# Altium schematic sheet Private_CPU_SerDes.SchDoc
size D
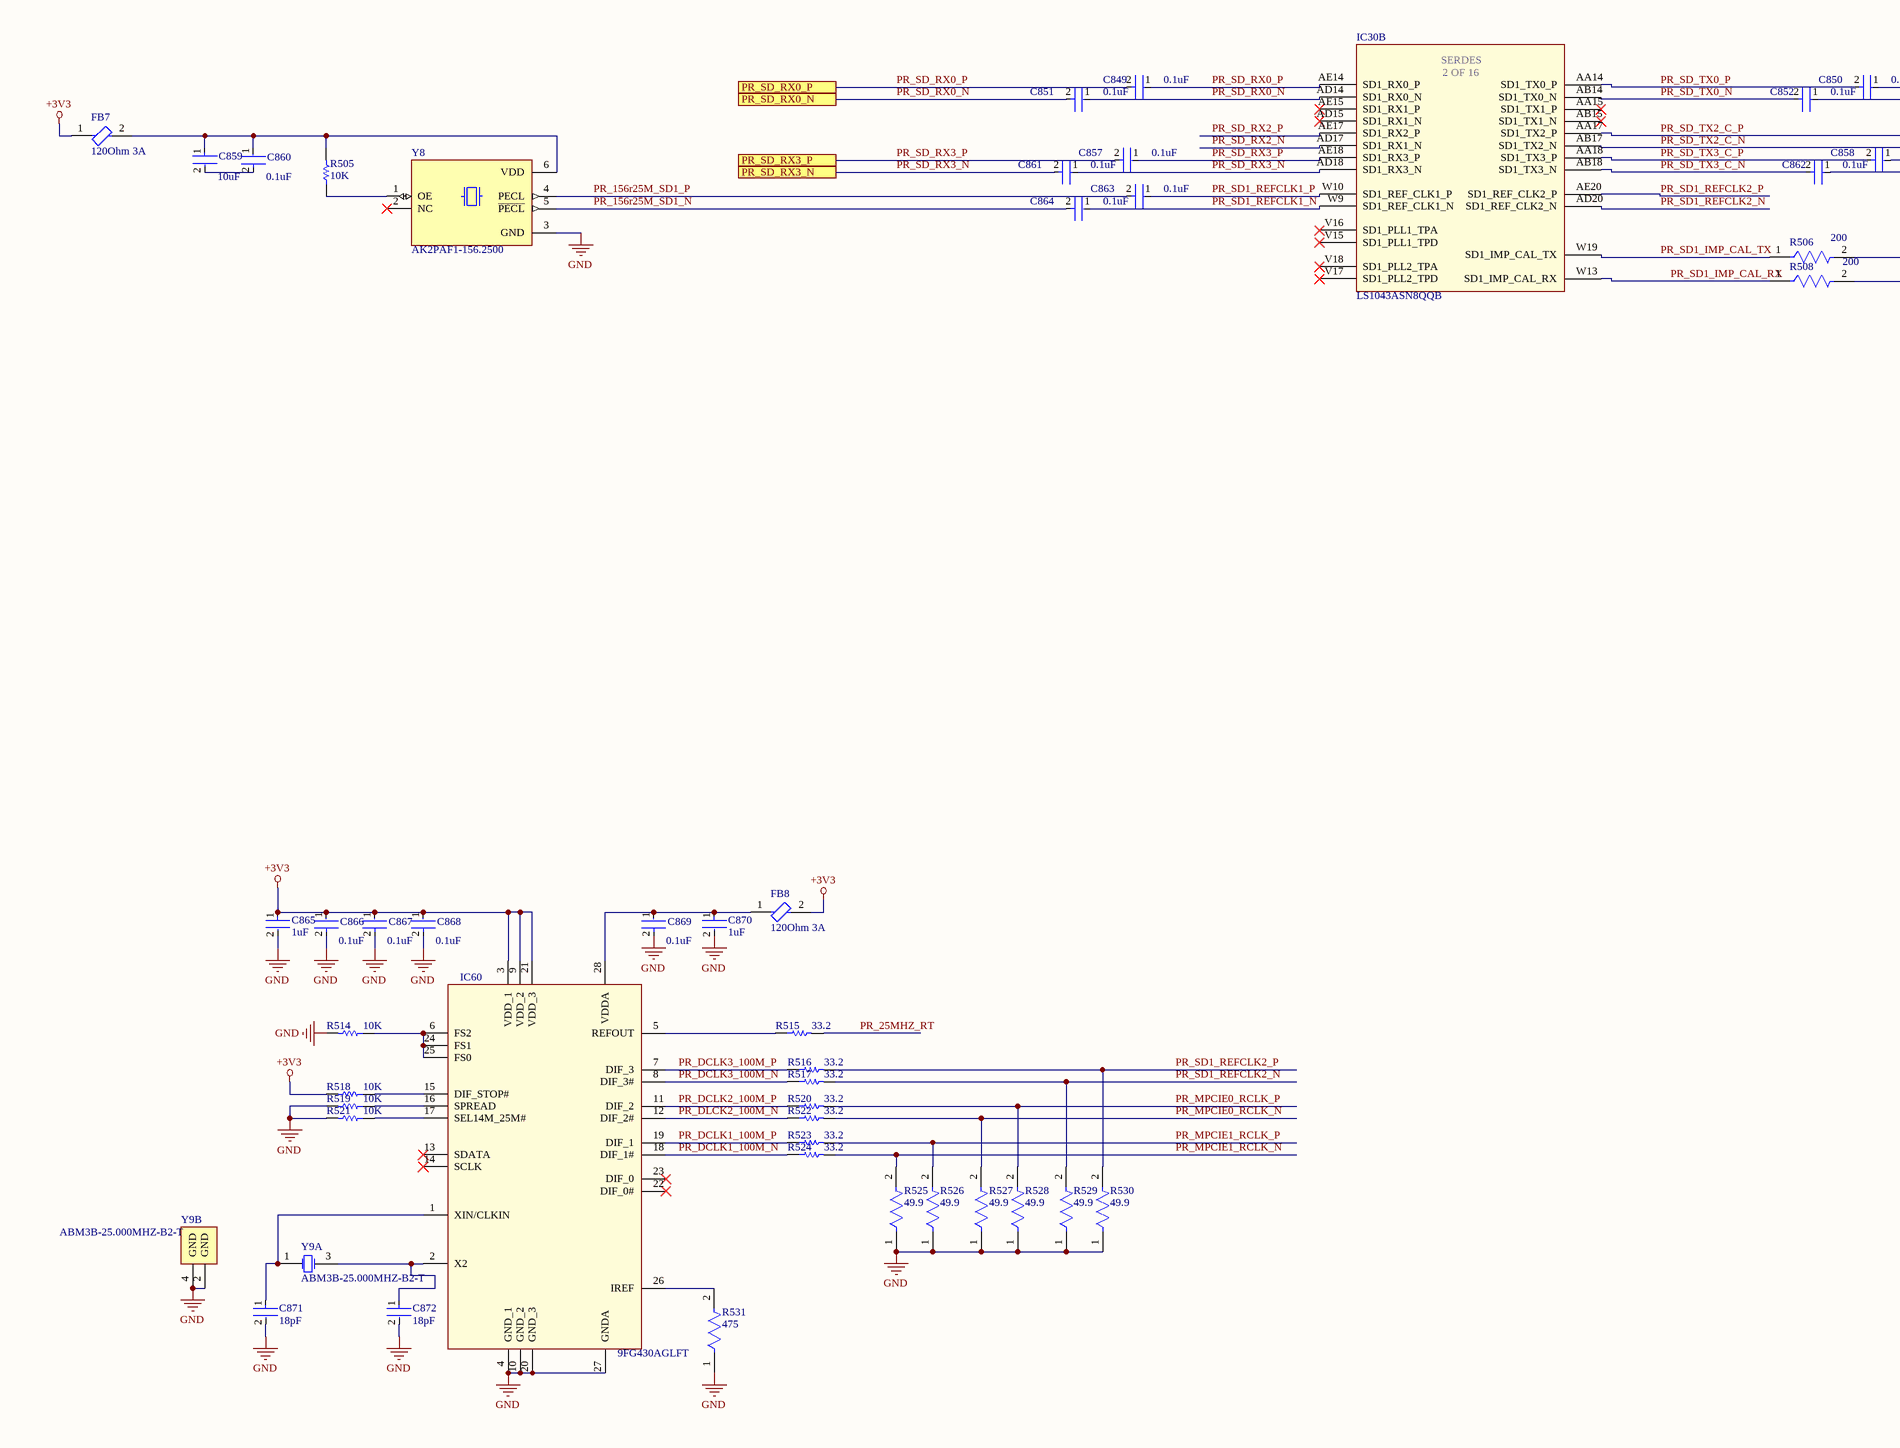
[diagram p0: Private_CPU_SerDes.SchDoc, left]
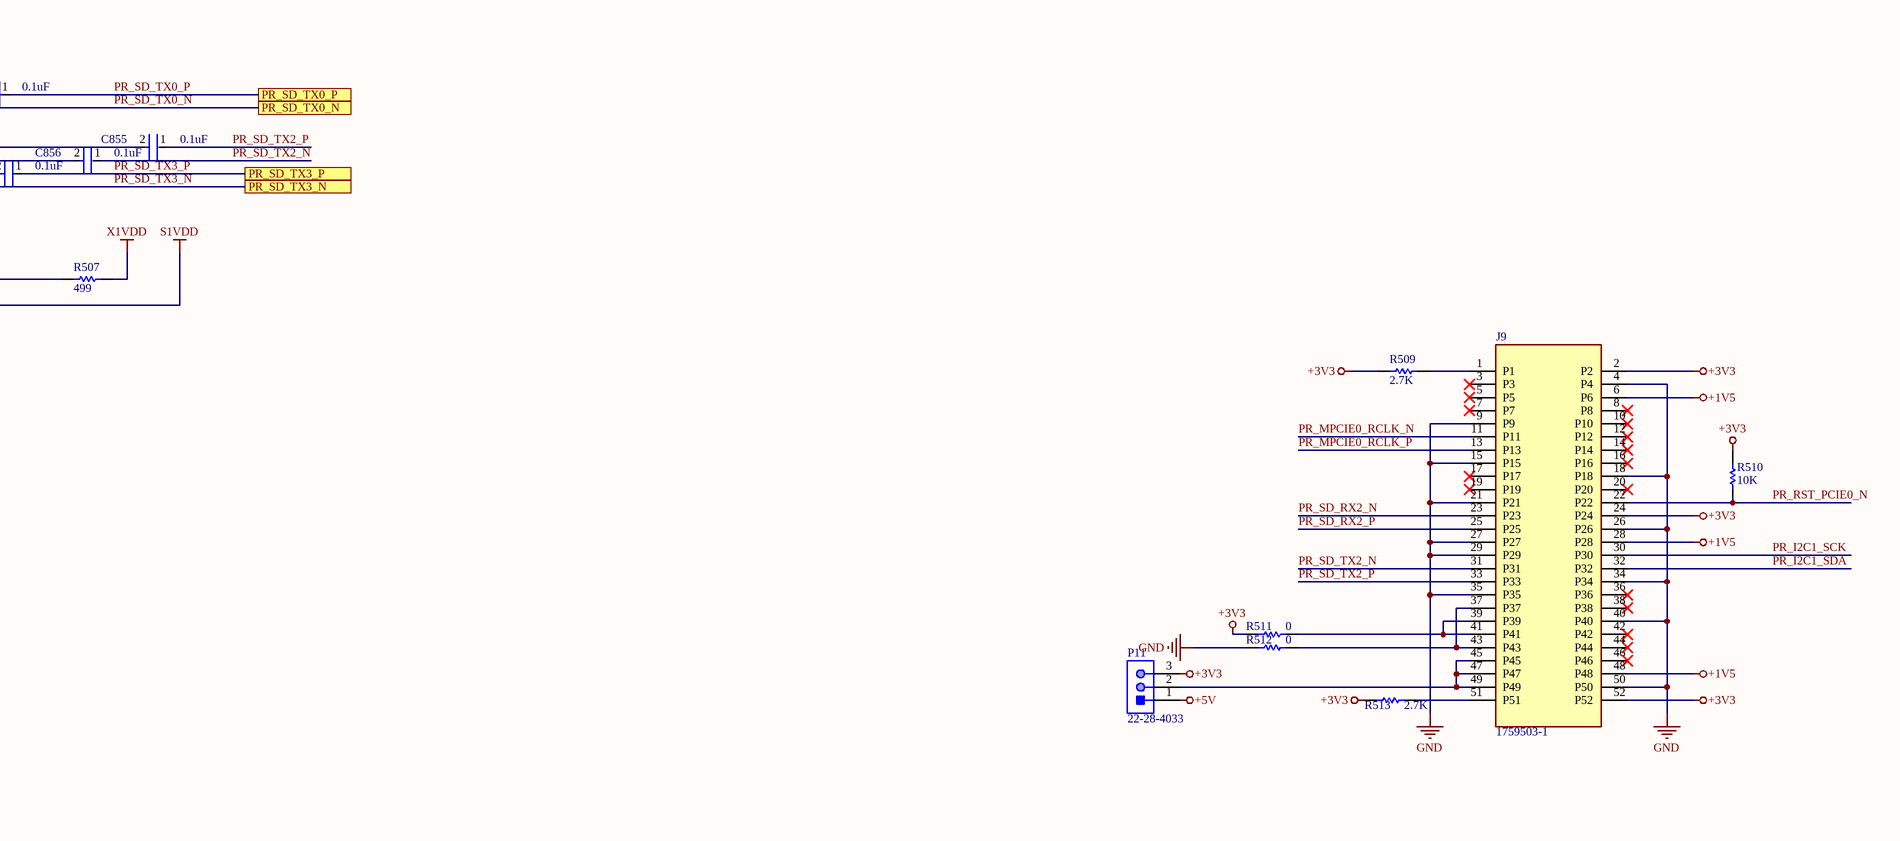
[diagram p1: Private_CPU_SerDes.SchDoc, right]

## Parts
C849  0.1uF  [FP-GRM15-MFG]
C850  0.1uF  [FP-GRM15-MFG]
C851  0.1uF  [FP-GRM15-MFG]
C852  0.1uF  [FP-GRM15-MFG]
C855  0.1uF  [FP-GRM15-MFG]
C856  0.1uF  [FP-GRM15-MFG]
C857  0.1uF  [FP-GRM15-MFG]
C858  0.1uF  [FP-GRM15-MFG]
C859  10uF  [FP-C0805C-DG-MFG]
C860  0.1uF  [FP-GRM15-MFG]
C861  0.1uF  [FP-GRM15-MFG]
C862  0.1uF  [FP-GRM15-MFG]
C863  0.1uF  [FP-GRM15-MFG]
C864  0.1uF  [FP-GRM15-MFG]
C865  1uF  [FP-GRM15-0_1-MFG]
C866  0.1uF  [FP-GRM15-MFG]
C867  0.1uF  [FP-GRM15-MFG]
C868  0.1uF  [FP-GRM15-MFG]
C869  0.1uF  [FP-GRM15-MFG]
C870  1uF  [FP-GRM15-0_1-MFG]
C871  18pF  [FP-C0402-BB-MFG]
C872  18pF  [FP-C0402-BB-MFG]
FB7  120Ohm 3A  [FP-BLM18-0_15-t0_5-d1_2-MFG]
FB8  120Ohm 3A  [FP-BLM18-0_15-t0_5-d1_2-MFG]
IC30  LS1043ASN8QQB  [BGA780C80P28X28_2300X2300X261]  (part B of 16)
IC60  9FG430AGLFT  [SOP65P640X120-28N]
J9  1759503-1  [TE_1759503-1]
P11  22-28-4033  [MOLX-22-28-4033_V]
R505  10K  [RESC1005X40X25LL05T05]
R506  200  [FP-CRCW0402-e3-IPC_C]
R507  499  [RESC1005X40X25LL05T05]
R508  200  [FP-CRCW0402-e3-IPC_C]
R509  2.7K  [RESC1005X40X25NL05T05]
R510  10K  [RESC1005X40X25LL05T05]
R511  0  [RESC2013X50X30LL20T20]
R512  0  [RESC2013X50X30LL20T20]
R513  2.7K  [RESC1005X40X25NL05T05]
R514  10K  [RESC1005X40X25LL05T05]
R515  33.2  [RESC1005X40X25LL05T05]
R516  33.2  [RESC1005X40X25LL05T05]
R517  33.2  [RESC1005X40X25LL05T05]
R518  10K  [RESC1005X40X25LL05T05]
R519  10K  [RESC1005X40X25LL05T05]
R520  33.2  [RESC1005X40X25LL05T05]
R521  10K  [RESC1005X40X25LL05T05]
R522  33.2  [RESC1005X40X25LL05T05]
R523  33.2  [RESC1005X40X25LL05T05]
R524  33.2  [RESC1005X40X25LL05T05]
R525  49.9  [FP-CRCW0402-e3-MFG]
R526  49.9  [FP-CRCW0402-e3-MFG]
R527  49.9  [FP-CRCW0402-e3-MFG]
R528  49.9  [FP-CRCW0402-e3-MFG]
R529  49.9  [FP-CRCW0402-e3-MFG]
R530  49.9  [FP-CRCW0402-e3-MFG]
R531  475  [FP-CRCW0603-e3-IPC_C]
Y8  AK2PAF1-156.2500  [XTAL_AK2PAF1-156.2500]
Y9  ABM3B-25.000MHZ-B2-T  [ABRA-ABM3B-4_V]  (parts A,B of 2)

## Ports
PR_SD_RX0_N, PR_SD_RX0_P, PR_SD_RX3_N, PR_SD_RX3_P, PR_SD_TX0_N, PR_SD_TX0_P, PR_SD_TX3_N, PR_SD_TX3_P

## Nets
+1V5: J9.6(P6) J9.28(P28) J9.48(P48)
+3V3: C865.1 C866.1 C867.1 C868.1 FB7.1 FB8.2 IC60.3(VDD_1) IC60.9(VDD_2) IC60.21(VDD_3) J9.2(P2) J9.24(P24) J9.52(P52) P11.3 R509.2 R510.2 R511.1 R513.2 R518.2
+5V: P11.1
GND: C865.2 C866.2 C867.2 C868.2 C869.2 C870.2 C871.2 C872.2 IC60.4(GND_1) IC60.10(GND_2) IC60.20(GND_3) IC60.27(GNDA) J9.4(P4) J9.9(P9) J9.15(P15) J9.18(P18) J9.21(P21) J9.26(P26) J9.27(P27) J9.29(P29) J9.34(P34) J9.35(P35) J9.40(P40) J9.50(P50) R512.1 R514.2 R519.2 R521.2 R525.1 R526.1 R527.1 R528.1 R529.1 R530.1 R531.1 Y8.3(GND) Y9.2(GND) Y9.4(GND)
S1VDD: R508.2
X1VDD: R507.2
PR_25MHZ_RT: R515.2
PR_156r25M_SD1_N: C864.2 Y8.5(~{PECL})
PR_156r25M_SD1_P: C863.2 Y8.4(PECL)
PR_DCLK1_100M_N: IC60.18(DIF_1#) R524.1
PR_DCLK1_100M_P: IC60.19(DIF_1) R523.1
PR_DCLK2_100M_P: IC60.11(DIF_2) R520.1
PR_DCLK3_100M_N: IC60.8(DIF_3#) R517.1
PR_DCLK3_100M_P: IC60.7(DIF_3) R516.1
PR_DLCK2_100M_N: IC60.12(DIF_2#) R522.1
PR_I2C1_SCK: J9.30(P30)
PR_I2C1_SDA: J9.32(P32)
PR_MPCIE0_RCLK_N: J9.11(P11) R522.2 R527.2
PR_MPCIE0_RCLK_P: J9.13(P13) R520.2 R528.2
PR_MPCIE1_RCLK_N: R524.2 R525.2
PR_MPCIE1_RCLK_P: R523.2 R526.2
PR_RST_PCIE0_N: J9.22(P22) R510.1
PR_SD1_IMP_CAL_RX: IC30.W13(SD1_IMP_CAL_RX) R508.1
PR_SD1_IMP_CAL_TX: IC30.W19(SD1_IMP_CAL_TX) R506.1
PR_SD1_REFCLK1_N: C864.1 IC30.W9(SD1_REF_CLK1_N)
PR_SD1_REFCLK1_P: C863.1 IC30.W10(SD1_REF_CLK1_P)
PR_SD1_REFCLK2_N: IC30.AD20(SD1_REF_CLK2_N) R517.2 R529.2
PR_SD1_REFCLK2_P: IC30.AE20(SD1_REF_CLK2_P) R516.2 R530.2
PR_SD_RX0_N: C851.1 C851.2 IC30.AD14(SD1_RX0_N) ; port PR_SD_RX0_N
PR_SD_RX0_P: C849.1 C849.2 IC30.AE14(SD1_RX0_P) ; port PR_SD_RX0_P
PR_SD_RX2_N: IC30.AD17(SD1_RX1_N) J9.23(P23)
PR_SD_RX2_P: IC30.AE17(SD1_RX2_P) J9.25(P25)
PR_SD_RX3_N: C861.1 C861.2 IC30.AD18(SD1_RX3_N) ; port PR_SD_RX3_N
PR_SD_RX3_P: C857.1 C857.2 IC30.AE18(SD1_RX3_P) ; port PR_SD_RX3_P
PR_SD_TX0_N: C852.1 C852.2 IC30.AB14(SD1_TX0_N) ; port PR_SD_TX0_N
PR_SD_TX0_P: C850.1 C850.2 IC30.AA14(SD1_TX0_P) ; port PR_SD_TX0_P
PR_SD_TX2_C_N: C856.2 IC30.AB17(SD1_TX2_N)
PR_SD_TX2_C_P: C855.2 IC30.AA17(SD1_TX2_P)
PR_SD_TX2_N: C856.1 J9.31(P31)
PR_SD_TX2_P: C855.1 J9.33(P33)
PR_SD_TX3_C_N: C862.2 IC30.AB18(SD1_TX3_N)
PR_SD_TX3_C_P: C858.2 IC30.AA18(SD1_TX3_P)
PR_SD_TX3_N: C862.1 ; port PR_SD_TX3_N
PR_SD_TX3_P: C858.1 ; port PR_SD_TX3_P
NetC859_1: C859.1 C860.1 FB7.2 R505.2 Y8.6(VDD)
NetC859_2: C859.2 C860.2
NetC869_1: C869.1 C870.1 FB8.1 IC60.28(VDDA)
NetC871_1: C871.1 IC60.1(XIN/CLKIN) Y9.1(X1)
NetC872_1: C872.1 IC60.2(X2) Y9.3(X2)
NetIC60_5: IC60.5(REFOUT) R515.1
NetIC60_6: IC60.6(FS2) IC60.24(FS1) IC60.25(FS0) R514.1
NetIC60_15: IC60.15(DIF_STOP#) R518.1
NetIC60_16: IC60.16(SPREAD) R519.1
NetIC60_17: IC60.17(SEL14M_25M#) R521.1
NetIC60_26: IC60.26(IREF) R531.2
NetJ9_1: J9.1(P1) R509.1
NetJ9_37: J9.37(P37) J9.43(P43) R512.2
NetJ9_39: J9.39(P39) J9.41(P41) R511.2
NetJ9_45: J9.45(P45) J9.47(P47) J9.49(P49) P11.2
NetJ9_51: J9.51(P51) R513.1
NetR505_1: R505.1 Y8.1(OE)
NetR506_2: R506.2 R507.1

Not connected (* = marked no-connect by the designer): IC30 AA15(SD1_TX1_P)* AB15(SD1_TX1_N)* AD15(SD1_RX1_N)* AE15(SD1_RX1_P)* V15(SD1_PLL1_TPD)* V16(SD1_PLL1_TPA)* V17(SD1_PLL2_TPD)* V18(SD1_PLL2_TPA)*; IC60 13(SDATA)* 14(SCLK)* 22(DIF_0#)* 23(DIF_0)*; J9 3(P3)* 5(P5)* 7(P7)* 8(P8)* 10(P10)* 12(P12)* 14(P14)* 16(P16)* 17(P17)* 19(P19)* 20(P20)* 36(P36)* 38(P38)* 42(P42)* 44(P44)* 46(P46)*; Y8 2(NC)*

## Notes on the sheet
- Title
- Size:
- Date:
- File:
- D
- Number:
- Time:
- Revision:
- Sheet
- of
- (in symbol LS1043ASN8QQB, part B) SERDES; 2 OF 16

## Library data of the parts
C849-C852 C855-C858 C860-C864 C866-C869 = CMP-2100-03641-2: CAP CER 0.1UF 16V X7R 0402; Manufacturer Part Number: GRM155R71C104KA88D; Manufacturer: Murata; Standoff Height: 0mm; Tolerance: 10%; Voltage Rating: 16Vdc; Material: Ceramic; Capacitance: 0.10μF; Value: 0.10μF; RoHS: TRUE; Temperature Characteristic: X7R; Octopart: https://octopart.com/grm155r71c104ka88d-murata-196880; Digikey Description: CAP CER 0.1UF 16V X7R 0402; Device Class L3: Ceramic Capacitors; Height: 0.55mm; ComponentLink2Description: Datasheet; Temperature Range Low: -55°C; Ipc Land Pattern Name: CAPC10050X219; ComponentLink2URL: https://search.murata.co.jp/Ceramy/image/img/A01X/G101/ENG/GRM155R71H471KA01-01A.pdf; Device Class L1: Passive Components; Lead Free: yes; Category: Cap; Package: GRM15; Temperature: -55°C to +125°C; Device Class L2: Capacitors; Temperature Range High: +125°C; Mouser Description: 0402 0.1 uF 16V ±10 % Tolerance X7R SMT Multilayer Ceramic Capacitor
C859 = CMP-2007-03243-2: CAP CER 10UF 10V X5R 0805; Manufacturer Part Number: C0805C106K8PACTU; Manufacturer: Kemet; 3DS Part Number: 220-00001; Tolerance: 10%; Temperature Coefficient: 15%; Material: Ceramic; Device Class L2: Capacitors; Device Class L1: Passive Components; ComponentLink2URL: https://content.kemet.com/datasheets/KEM_C1006_X5R_SMD.pdf; Height: 1.4mm; Lead Free: Yes; Digikey Description: CAP CER 10UF 10V X5R 0805; Octopart: https://octopart.com/c0805c106k8pactu-kemet-98697; Capacitance: 10uF; Value: 10uF; Temperature Range Low: -55°C; Temperature: -55°C to +85°C; Automotive: No; Mouser Description: CAP CER 10UF 10V X5R 0805; Ipc Land Pattern Name: CAPC200125X125; Temperature Range High: +85°C; Voltage: 10V; RoHS: TRUE; Device Class L3: Ceramic Capacitors; ComponentLink2Description: Datasheet; Voltage Rating: 10V; Package: C0805C-DG; Temperature Characteristic: X5R; Category: Cap
C865 C870 = CMP-2008-04556-2: CAP CER 1UF 10V X5R 0402; Manufacturer Part Number: GRM155R61A105KE15D; Manufacturer: Murata; Material: Ceramic; Tolerance: 10%; Temperature Coefficient: 15%; Octopart: https://octopart.com/grm155r61a105ke15d-murata-197442; Lead Free: Yes; ComponentLink2Description: Datasheet; Temperature: -55°C to +85°C; Temperature Range High: +85°C; Height: 0.55mm; Capacitance: 1uF; Ipc Land Pattern Name: CAPC10050X50; ComponentLink2URL: https://search.murata.co.jp/Ceramy/image/img/A01X/G101/ENG/GRM155R61A105KE15-01A.pdf; Temperature Range Low: -55°C; Device Class L2: Capacitors; Voltage Rating: 10V; RoHS: TRUE; Device Class L1: Passive Components; Device Class L3: Ceramic Capacitors; Temperature Characteristic: X5R; Mouser Description: 0402 1 uF 10 V ±10% Tolerance X5R Surface Mount Multilayer Ceramic Capacitor; Automotive: No; Package: GRM15-0.1; Digikey Description: CAP CER 1UF 10V X5R 0402; Value: 1uF; Category: Cap
C871 C872 = CMP-2008-03288-2: CAP CER 18PF 50V 5% NP0 0402; Manufacturer Part Number: C0402C180J5GACTU; Manufacturer: Kemet; Temperature Coefficient: 15%; Temperature Characteristic: C0G; Tolerance: 0.05; Material: Ceramic; Ipc Land Pattern Name: CAPC10050X50; Capacitance: 18 pF; Category: Cap; RoHS: TRUE; Automotive: No; Temperature Range High: +125°C; Height: 0.55mm; ComponentLink2Description: Datasheet; Lead Free: Yes; Value: 18 pF; Device Class L3: Ceramic Capacitors; Device Class L1: Passive Components; Digikey Description: CAP CER 18PF 50V 5% NP0 0402; Device Class L2: Capacitors; Voltage Rating: 50 V; ComponentLink2URL: https://content.kemet.com/datasheets/KEM_C1002_X7R_SMD.pdf; Octopart: https://octopart.com/c0402c180j5gactu-kemet-9138803; Mouser Description: Multilayer Ceramic Capacitors MLCC - SMD/SMT 50volts 18pF C0G 5%; Temperature: -55°C to +125°C; Temperature Range Low: -55°C; Package: C0402-BB
FB7 FB8 = CMP-0686-00602-4: Chip Ferrite Bead, 0603, 120Ω @ 100MHz, 25%, 0.025Ω, 3A; DC Resistance (DCR): 25mR; Shielding: Unshielded; Material: Steel; Number of Circuits: 1; Impedance: 120R; Tolerance: 25%; REACH SVHC: No SVHC; Case/Package: 0603; Max DC Current: 3A; Core Material: Ferrite; Case Code (Metric): 1608; Frequency: 100MHz; Package Quantity: 1; Height: 0.8mm; Lead Free: Lead Free; Test Frequency: 100MHz; RoHS Compliant: Yes; DC Resistance-Max: 25mR; Min Operating Temperature: -55°C; Width: 0.8mm; Termination: SMD/SMT; Length: 1.6mm; Max Current Rating: 3A; Number of Lines: 1; Series: BLM18S; Number of Pins: 2; Packaging: Tape and Reel; Current Rating: 3A; Depth: 0.8mm; Case Code (Imperial): 0603; Max Operating Temperature: 125°C
IC30 = LS1043ASN8QQB: Integrated Circuit; Manufacturer_Name: NXP; Datasheet Link: http://www.nxp.com/secured/assets/documents/en/data-sheet/LS1088A.pdf; Height: 2.61mm; Manufacturer_Part_Number: LS1043ASN8QQB; Mouser Part Number: 771-LS1043ASN8QQB; Mouser Price/Stock: https://www.mouser.co.uk/ProductDetail/NXP-Semiconductors/LS1043ASN8QQB/?qs=AQlKX63v8RsTATOTx7X0Jg%3D%3D
IC60 = 9FG430AGLFT: Integrated Circuit; Manufacturer_Name: IDT; Datasheet Link: https://www.idt.com/document/dst/9fg430-datasheet; Height: 1.2mm; Manufacturer_Part_Number: 9FG430AGLFT
J9 = 1759503-1: mini PCI-E 8H Type I PKG G/F; MF: {'manufacturer': u'TE Connectivity'}; MP: 1759503-1; Value: *; Price: None; Availability: Unavailable; Package: None
P11 = CMP-1676-00001-5: Male Header, Pitch 2.54 mm, 1 x 3 Position, Height 8.38 mm, Tail Length 3.18 mm, RoHS, Bulk; Manufacturer: Molex; Rows: 1; Voltage Rating: 250 V; Current Rating: 4 A; Min Operating Temperature: 0 degC; Lead Pitch: 0.1 inch; Packaging: Bulk; Contact Finish: Gold; RoHSCompliant: true; Contact Material: Brass; PackageReference: 22-28-4033; REACH SVHC: Unknown; PackageDescription: Male Header, Pitch 2.54 mm, 1 x 3 Position, Height 8.38 mm, Tail Length 3.18 mm; ComponentLink2URL: http://www.molex.com/pdm_docs/sd/022284033_sd.pdf; Height: 8.38 mm; Mounting Technology: Through Hole; ComponentLink1Description: Manufacturer URL; Length: 7.62 mm; Mount: Through Hole; DatasheetVersion: Rev. G, 01/2012; Max Operating Temperature: 75 degC; ComponentLink2Description: Datasheet; Colour: Black; Pins: 3; Contact Plating: Gold; Package Quantity: 1; ComponentLink1URL: http://www.molex.com/
R505 R510 R514 R518 R519 R521 = CMP-2000-07588-1: Chip Resistor, 10 KOhm, +/- 1%, 0.1 W, -55 to 155 degC, 0402 (1005 Metric), RoHS, Tape and Reel; Manufacturer: Panasonic; Power Rating: 100mW; Voltage Rating: 50V; Resistance: 10KOhm; Case\/Package: 0402; Temperature Coefficient: 100ppm\/degreesC; RoHSCompliant: True; Lead Free: LeadFree; Package Quantity: 1; Contact Plating: Tin; Length: 1mm; Radiation Hardening: No; REACH SVHC: NoSVHC; Max Operating Temperature: 155degC; Depth: 0.5mm; Case Code (Imperial): 0402; Military Standard: Not; Package Description: 2-Pin Surface Mount Device, Body 1 x 0.5 mm; Termination: SMD/SMT; Case Code (Metric): 1005; Height: 0.35mm; Packaging: TapeandReel; Voltage Rating (DC): 50V; Package Reference: 402; Number of Pins: 2; Tolerance: 1%; Mounting Technology: SurfaceMount; Width: 0.02inch; Mount: SurfaceMount; Datasheet URL: https://industrial.panasonic.com/cdbs/www-data/pdf/RDA0000/AOA0000C304.pdf; Composition: ThickFilm; Datasheet Version: 02/2017; Manufacturer URL: http://www.panasonic.com/; Max Power Dissipation: 100mW; Number of Terminations: 2; Min Operating Temperature: -55degC
R506 R508 = CMP-1011-00429-3: RES Thick Film, 200Ω, 1%, 0.063W, 100ppm/°C, 0402; Max Power Dissipation: 63mW; Voltage Rating: 50V; Resistance: 200R; Termination: SMD/SMT; Weight: 2.3E-05oz; Case/Package: 0402; Contact Plating: Tin; Number of Pins: 2; Width: 0.5mm; Height: 0.35mm; Case Code (Metric): 1005; Military Standard: Not; Features: Automotive AEC-Q200; Power Rating: 63mW; Temperature Coefficient: 100ppm/°C; Tolerance: 1%; Lead Free: Lead Free; Depth: 0.5mm; Max Operating Temperature: 155°C; Min Operating Temperature: -55°C; Package Quantity: 10; Voltage Rating (DC): 50V; Composition: Thick Film; Mount: Surface Mount; Radiation Hardening: No; Length: 1mm; Packaging: Tape and Reel; Number of Terminations: 2; Case Code (Imperial): 0402
R507 = CMP-2002-00965-1: Manufacturer: Panasonic; Part Number: ERJ-2RKF4990X
R509 R513 = CMP-1011-00557-2: Part Number: ERJ2RKF2701X; Manufacturer: Panasonic
R511 R512 = CMP-2001-04896-1: Manufacturer: Vishay Dale; Part Number: CRCW08050000Z0EA
R515-R517 R520 R522-R524 = CMP-2002-08532-1: Part Number: CRCW040233R2FKED; Manufacturer: Vishay Dale
R525-R530 = CMP-1011-00363-3: RES Thick Film, 49.9Ω, 1%, 0.063W, 100ppm/°C, 0402; Resistance: 49.9R; Voltage Rating: 50V; Power Rating: 63mW; Temperature Coefficient: 100ppm/°C; Packaging: Tape and Reel; Height: 0.35mm; Length: 1mm; Case Code (Metric): 1005; Weight: 2.3E-05oz; Case Code (Imperial): 0402; Voltage Rating (DC): 50V; Composition: Thick Film; Lead Free: Lead Free; Package Quantity: 10; Number of Terminations: 2; Width: 0.5mm; Max Operating Temperature: 155°C; Depth: 0.5mm; Max Power Dissipation: 63mW; Tolerance: 1%; Radiation Hardening: No; Features: Automotive AEC-Q200; Min Operating Temperature: -55°C; Contact Plating: Tin; Mount: Surface Mount; Military Standard: Not; Termination: SMD/SMT; Case/Package: 0402
R531 = CMP-2000-03377-2: RES Thick Film, 475Ω, 1%, 0.1W, 100ppm/°C, 0603; Voltage Rating (DC): 75V; Power Rating: 100mW; Resistance: 475R; Termination: SMD/SMT; Weight: 7.1E-05oz; Case Code (Imperial): 0603; Tolerance: 1%; Case/Package: 0603; Length: 1.55mm; Case Code (Metric): 1608; Packaging: Tape and Reel; Max Operating Temperature: 155°C; Width: 0.033inch; Temperature Coefficient: 100ppm/°C; Contact Plating: Tin; Composition: Thick Film; Voltage Rating: 75V; Number of Terminations: 2; Depth: 0.85mm; Lead Free: Lead Free; Height: 0.45mm; Features: Automotive AEC-Q200; Package Quantity: 10; Military Standard: Not; Max Power Dissipation: 100mW; Radiation Hardening: No; Min Operating Temperature: -55°C; Mount: Surface Mount
Y8 = AK2PAF1-156.2500: XTAL OSC XO 156.25MHZ 3.3V LVPEC.   MANUFACTURER: ABRACON; MF: {'manufacturer': u'Abracon LLC'}; Package: None; MP: AK2PAF1-156.2500; Availability: Unavailable; Price: None; Value: *
Y9 = CMP-0277-00001-1: Crystal, SMD, 25.000000MHz Stab=50ppm 18.0pF; Manufacturer: Abracon; Packing Type: Tape & Reel; Body Shape: Rectangular; Case Size: 5.0 x 3.2 mm; PackageDescription: 4-Pin SMT Crystal, 5.2 x 3.4 mm Body; ComponentLink2Description: Datasheet; Mounting Technology: Surface Mount; ComponentLink1URL: http://www.abracon.com/; PackageReference: ABM3B; DatasheetVersion: Apr-13; PartNumber: ABM3B-25.000MHZ-B2-T; ComponentLink2URL: http://www.abracon.com/Resonators/abm3b.pdf; ComponentLink1Description: Manufacturer URL; Storage Temperature: -40 to 80 degC